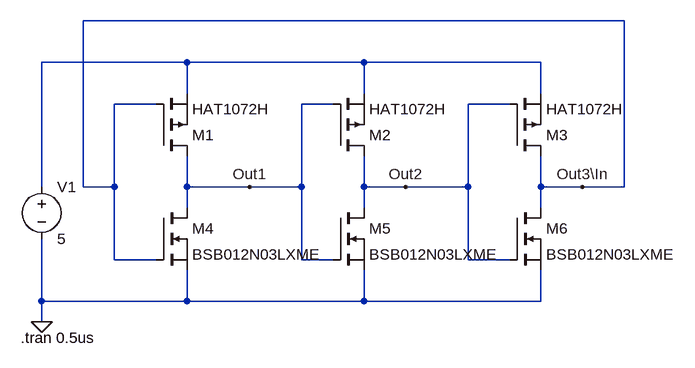
[diagram p0: schematic RingOscillator.asc]
RingOscillator.asc, the LTspice schematic file:
Version 4
SHEET 1 1252 680
WIRE 480 -288 -352 -288
WIRE -192 -224 -416 -224
WIRE 80 -224 -192 -224
WIRE 352 -224 80 -224
WIRE -192 -176 -192 -224
WIRE 80 -176 80 -224
WIRE 352 -176 352 -224
WIRE -240 -160 -304 -160
WIRE 32 -160 -16 -160
WIRE 304 -160 240 -160
WIRE -416 -32 -416 -224
WIRE -352 -32 -352 -288
WIRE -304 -32 -304 -160
WIRE -304 -32 -352 -32
WIRE -192 -32 -192 -80
WIRE -96 -32 -192 -32
WIRE -16 -32 -16 -160
WIRE -16 -32 -96 -32
WIRE 80 -32 80 -80
WIRE 144 -32 80 -32
WIRE 240 -32 240 -160
WIRE 240 -32 144 -32
WIRE 352 -32 352 -80
WIRE 416 -32 352 -32
WIRE 480 -32 480 -288
WIRE 480 -32 416 -32
WIRE -192 0 -192 -32
WIRE 80 0 80 -32
WIRE 352 0 352 -32
WIRE -304 80 -304 -32
WIRE -240 80 -304 80
WIRE -16 80 -16 -32
WIRE 32 80 -16 80
WIRE 240 80 240 -32
WIRE 304 80 240 80
WIRE -416 144 -416 48
WIRE -192 144 -192 96
WIRE -192 144 -416 144
WIRE 80 144 80 96
WIRE 80 144 -192 144
WIRE 352 144 352 96
WIRE 352 144 80 144
WIRE -416 176 -416 144
FLAG -416 176 0
FLAG -96 -32 Out1
FLAG 144 -32 Out2
FLAG 416 -32 Out3\In
SYMBOL pmos -240 -80 M180
SYMATTR InstName M1
SYMATTR Value HAT1072H
SYMBOL pmos 32 -80 M180
SYMATTR InstName M2
SYMATTR Value HAT1072H
SYMBOL pmos 304 -80 M180
SYMATTR InstName M3
SYMATTR Value HAT1072H
SYMBOL nmos -240 0 R0
SYMATTR InstName M4
SYMATTR Value BSB012N03LXME
SYMBOL nmos 32 0 R0
SYMATTR InstName M5
SYMATTR Value BSB012N03LXME
SYMBOL nmos 304 0 R0
SYMATTR InstName M6
SYMATTR Value BSB012N03LXME
SYMBOL voltage -416 -48 R0
WINDOW 123 0 0 Left 0
WINDOW 39 0 0 Left 0
SYMATTR InstName V1
SYMATTR Value 5
TEXT -448 200 Left 2 !.tran 0.5us

The netlist it stands for:
* RingOscillator.asc
M1 Out1 Out3\In N001 N001 HAT1072H
M2 Out2 Out1 N001 N001 HAT1072H
M3 Out3\In Out2 N001 N001 HAT1072H
M4 Out1 Out3\In 0 0 BSB012N03LXME
M5 Out2 Out1 0 0 BSB012N03LXME
M6 Out3\In Out2 0 0 BSB012N03LXME
V1 N001 0 5
.model NMOS NMOS
.model PMOS PMOS
.lib standard.mos
.tran 0.5us
.backanno
.end